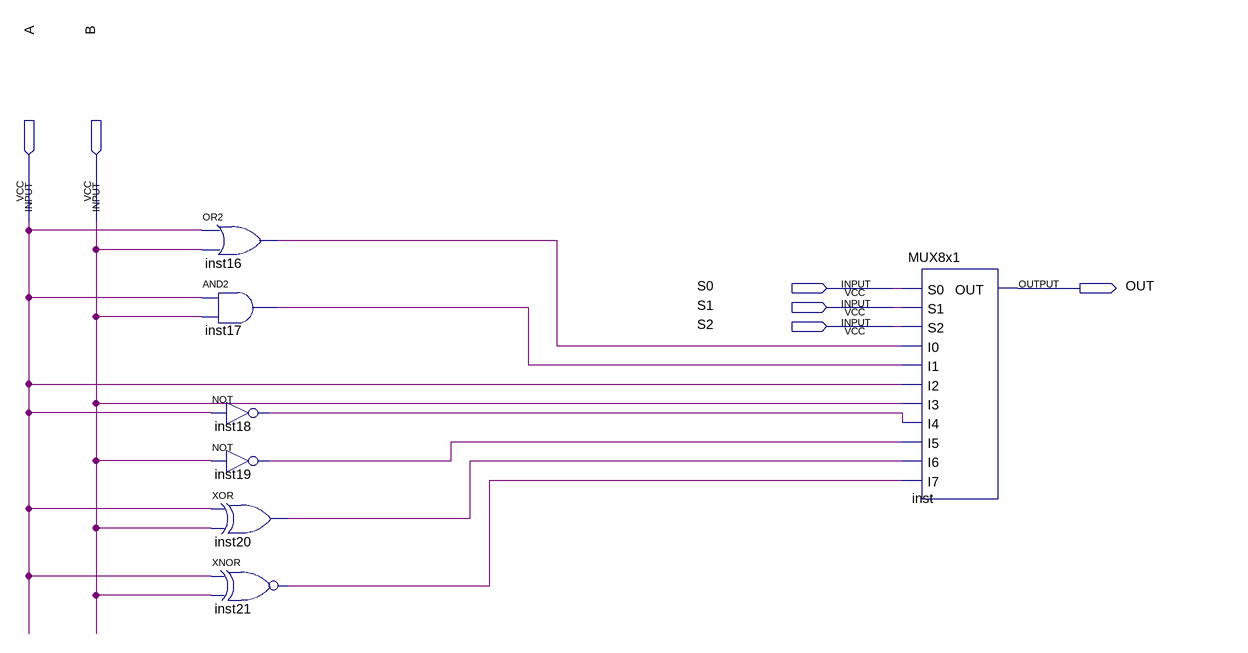
[diagram p0: schematic sheet]
// Quartus schematic UL1Bit.bdf as structural Verilog: 7 symbols, 6 pins
module UL1Bit (
  input  A,
  input  B,
  input  S0,
  input  S1,
  input  S2,
  output OUT
);

  wire inst16_out, inst17_out, inst18_out, inst19_out, inst20_out, inst21_out;

  or inst16 (inst16_out, A, B);
  and inst17 (inst17_out, A, B);
  not inst18 (inst18_out, A);
  not inst19 (inst19_out, B);
  xor inst20 (inst20_out, A, B);
  xnor inst21 (inst21_out, A, B);
  MUX8x1 inst (
    .S0(S0), .S1(S1), .S2(S2), .I0(inst16_out), .I1(inst17_out), .I2(A), .I3(B), .I4(inst18_out),
    .I5(inst19_out), .I6(inst20_out), .I7(inst21_out), .OUT(OUT));
endmodule
